# EAGLE design cardampl1 (EAGLE 5.08)
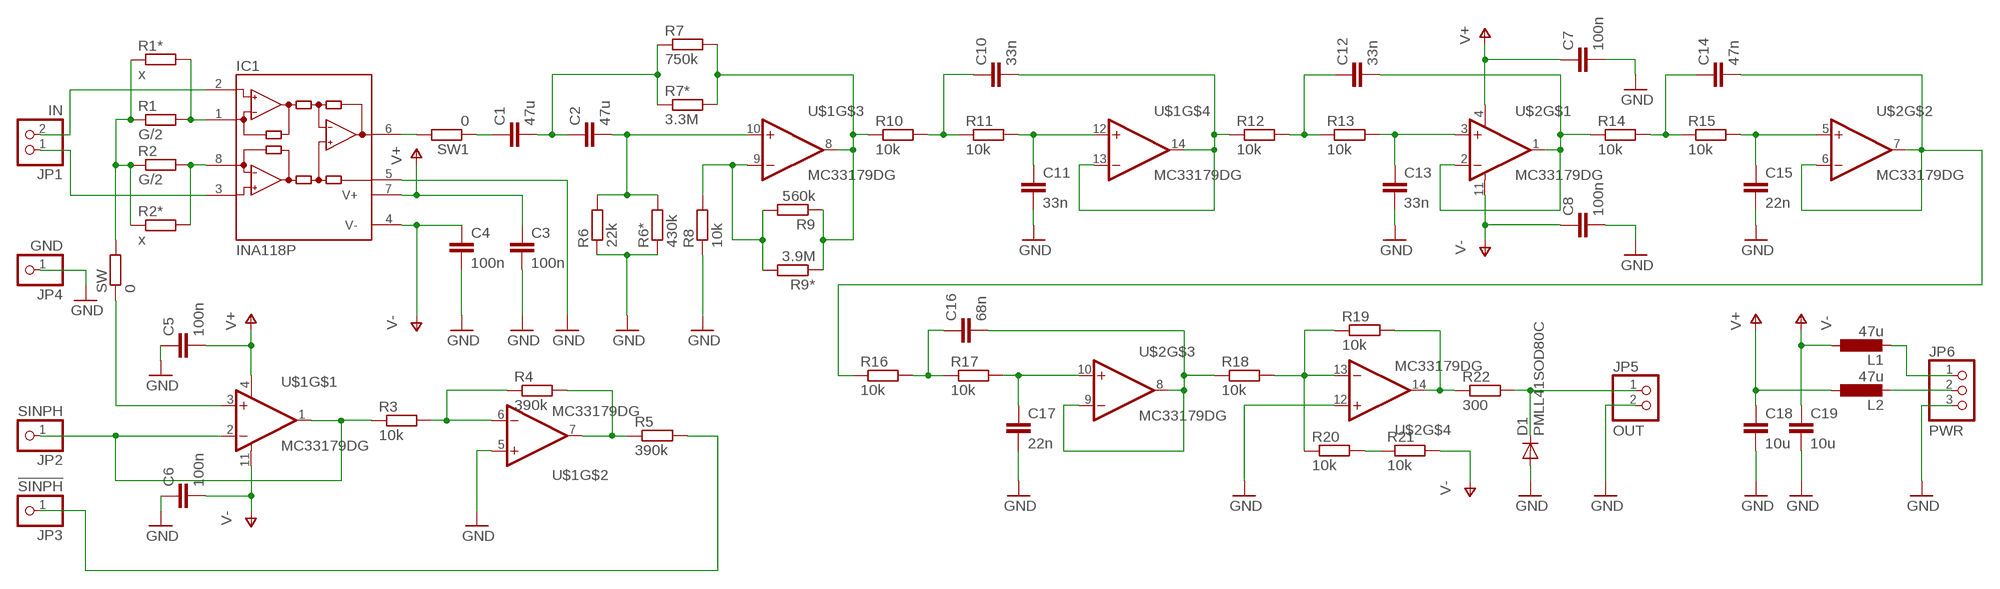
[diagram p0: schematic, sheet 1]

## Parts
C1  47u  C-EU025-050X050  [C025-050X050]
C2  47u  C-EU025-050X050  [C025-050X050]
C3  100n  C-EUC1206  [C1206]
C4  100n  C-EUC1206  [C1206]
C5  100n  C-EUC1206  [C1206]
C6  100n  C-EUC1206  [C1206]
C7  100n  C-EUC1206  [C1206]
C8  100n  C-EUC1206  [C1206]
C10  33n  C-EU050-075X075  [C050-075X075]
C11  33n  C-EU050-075X075  [C050-075X075]
C12  33n  C-EU050-075X075  [C050-075X075]
C13  33n  C-EU050-075X075  [C050-075X075]
C14  47n  C-EU050-075X075  [C050-075X075]
C15  22n  C-EU050-075X075  [C050-075X075]
C16  68n  C-EU050-075X075  [C050-075X075]
C17  22n  C-EU050-075X075  [C050-075X075]
C18  10u  C-EUC1206  [C1206]
C19  10u  C-EUC1206  [C1206]
D1  PMLL41SOD80C  [SOD80C]
IC1  INA118P  [DIL08]
JP1  IN  PINHD-1X2  [1X02]
JP2  SINPH  PINHD-1X1  [1X01]
JP3  !SINPH  PINHD-1X1  [1X01]
JP4  GND  PINHD-1X1  [1X01]
JP5  OUT  PINHD-1X2  [1X02]
JP6  PWR  PINHD-1X3/90  [1X03/90]
L1  47u  L-EUL1812  [L1812]
L2  47u  L-EUL1812  [L1812]
R1  G/2  R-EU_0207/15  [0207/15]
R1*  x  R-EU_0207/15  [0207/15]
R2  G/2  R-EU_0207/15  [0207/15]
R2*  x  R-EU_0207/15  [0207/15]
R3  10k  R-EU_R1206  [R1206]
R4  390k  R-EU_R1206  [R1206]
R5  390k  R-EU_R1206  [R1206]
R6  22k  R-EU_0207/12  [0207/12]
R6*  430k  R-EU_0207/12  [0207/12]
R7  750k  R-EU_0207/12  [0207/12]
R7*  3.3M  R-EU_0207/12  [0207/12]
R8  10k  R-EU_R0805  [R0805]
R9  560k  R-EU_0207/12  [0207/12]
R9*  3.9M  R-EU_0207/12  [0207/12]
R10  10k  R-EU_R0805  [R0805]
R11  10k  R-EU_R0805  [R0805]
R12  10k  R-EU_R0805  [R0805]
R13  10k  R-EU_R0805  [R0805]
R14  10k  R-EU_R0805  [R0805]
R15  10k  R-EU_R0805  [R0805]
R16  10k  R-EU_R0805  [R0805]
R17  10k  R-EU_R0805  [R0805]
R18  10k  R-EU_R0805  [R0805]
R19  10k  R-EU_R0805  [R0805]
R20  10k  R-EU_R0805  [R0805]
R21  10k  R-EU_R0805  [R0805]
R22  300  R-EU_R0805  [R0805]
SW  0  R-EU_M0805  [M0805]
SW1  0  R-EU_M0805  [M0805]
U$1  MC33179DG  [SO14]
U$2  MC33179DG  [SO14]

## Nets
GND: C3.2 C4.2 C5.1 C6.1 C7.2 C8.2 C11.2 C13.2 C15.2 C17.2 C18.2 C19.2 D1.A IC1.5(REF) JP4.1 JP5.2 JP6.3 R6*.1 R6.1 R8.1 U$1.5(+IN) U$2.12(+IN)
N$1: IC1.2(-IN) JP1.2
N$2: IC1.3(+IN) JP1.1
N$3: IC1.1(RG) R1*.2 R1.2
N$4: IC1.8(RG) R2*.2 R2.2
N$5: SW.1 U$1.3(+IN)
N$6: JP2.1 R3.1 U$1.1(OUT) U$1.2(-IN)
N$7: C10.1 R10.2 R11.1
N$8: R3.2 R4.1 U$1.6(-IN)
N$9: R18.2 R19.1 R20.1 U$2.13(-IN)
N$10: R4.2 R5.1 U$1.7(OUT)
N$11: JP3.1 R5.2
N$12: C13.1 R13.2 U$2.3(+IN)
N$13: C11.1 R11.2 U$1.12(+IN)
N$14: R19.2 R22.1 U$2.14(OUT)
N$15: C12.2 R14.1 U$2.1(OUT) U$2.2(-IN)
N$16: IC1.6(OUT) SW1.2
N$17: R1*.1 R1.1 R2*.1 R2.1 SW.2
N$18: C1.1 SW1.1
N$19: D1.C JP5.1 R22.2
N$20: C2.2 R6*.2 R6.2 U$1.10(+IN)
N$21: JP6.1 L1.2
N$22: R8.2 R9*.2 R9.2 U$1.9(-IN)
N$23: C10.2 R12.1 U$1.13(-IN) U$1.14(OUT)
N$24: JP6.2 L2.2
N$25: C12.1 R12.2 R13.1
N$26: C14.1 R14.2 R15.1
N$27: C16.1 R16.2 R17.1
N$28: R7*.2 R7.2 R9*.1 R9.1 R10.1 U$1.8(OUT)
N$29: C1.2 C2.1 R7*.1 R7.1
N$30: R20.2 R21.1
N$31: C15.1 R15.2 U$2.5(+IN)
N$32: C14.2 R16.1 U$2.6(-IN) U$2.7(OUT)
N$33: C16.2 R18.1 U$2.8(OUT) U$2.9(-IN)
N$35: C17.1 R17.2 U$2.10(+IN)
V+: C3.1 C5.2 C7.1 C18.1 IC1.7(V+) L2.1 U$1.4(V+) U$2.4(V+)
V-: C4.1 C6.2 C8.1 C19.1 IC1.4(V-) L1.1 R21.2 U$1.11(V-) U$2.11(V-)

## Library data of the parts
C1-C8 C10-C19 = rcl:C-EU: CAPACITOR, European symbol
D1 = diode:PMLL41*: High-speed diodes Source: http://www.semiconductors.philips.com/acrobat_download/datasheets/PMLL4150_2.pdf
IC1 = burr-brown:INA118: Instrumentation Amplifier Precision, Low Power
JP1 JP5 = pinhead:PINHD-1X2: PIN HEADER
JP2-JP4 = pinhead:PINHD-1X1: PIN HEADER
JP6 = pinhead:PINHD-1X3: PIN HEADER
L1 L2 = rcl:L-EU: INDUCTOR, European symbol
R1 R1* R2 R2* R6 R6* R7 R7* R8 R9 R9* R10-R22 SW SW1 = rcl:R-EU_: RESISTOR, European symbol
R3-R5 = resistor:R-EU_: RESISTOR, European symbol
U$1 U$2 = OU:MC33179DG

## Board
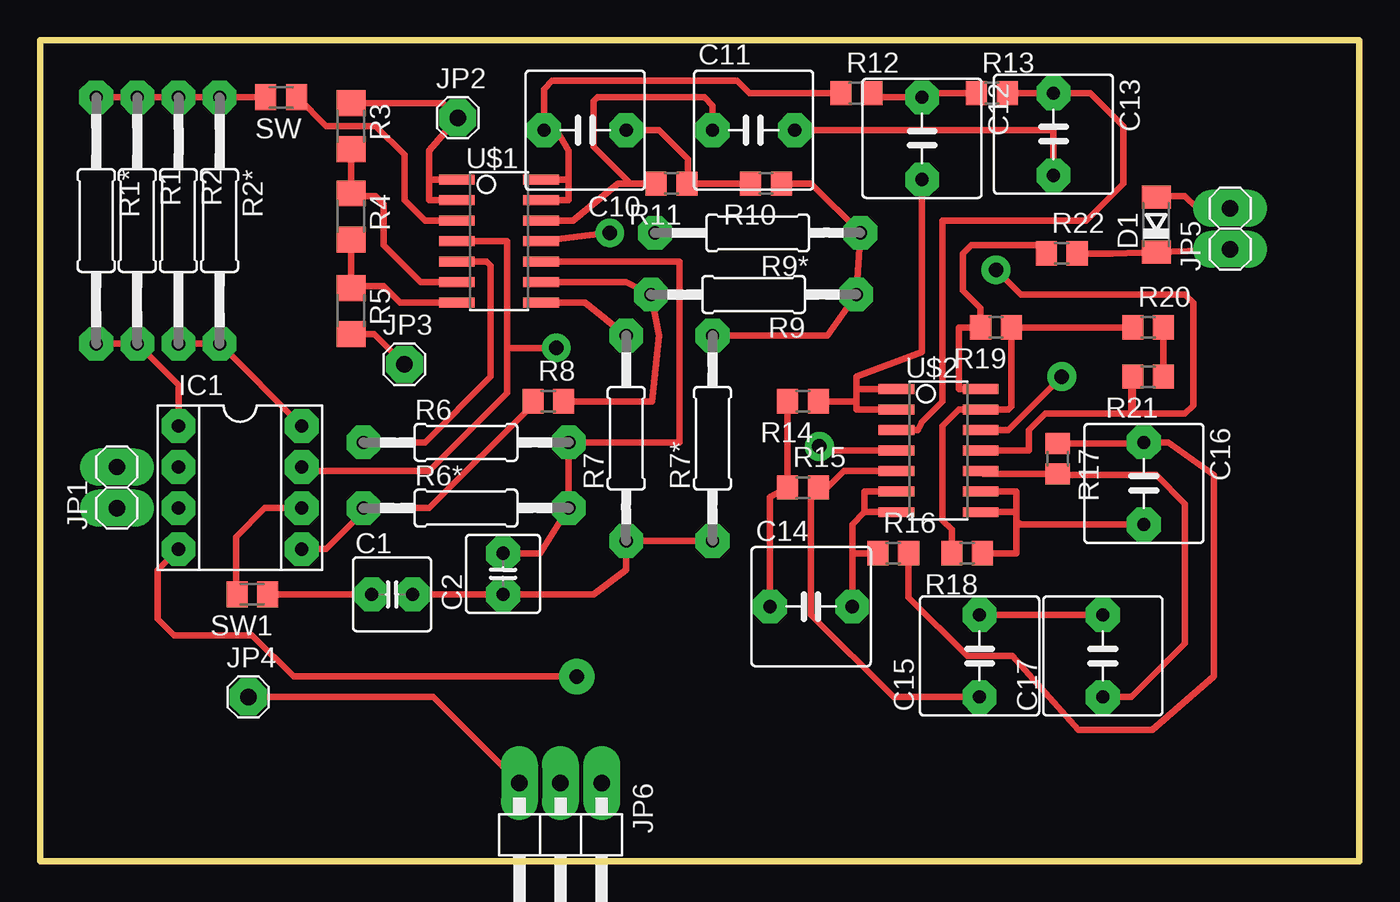
[diagram p1: board, top side]
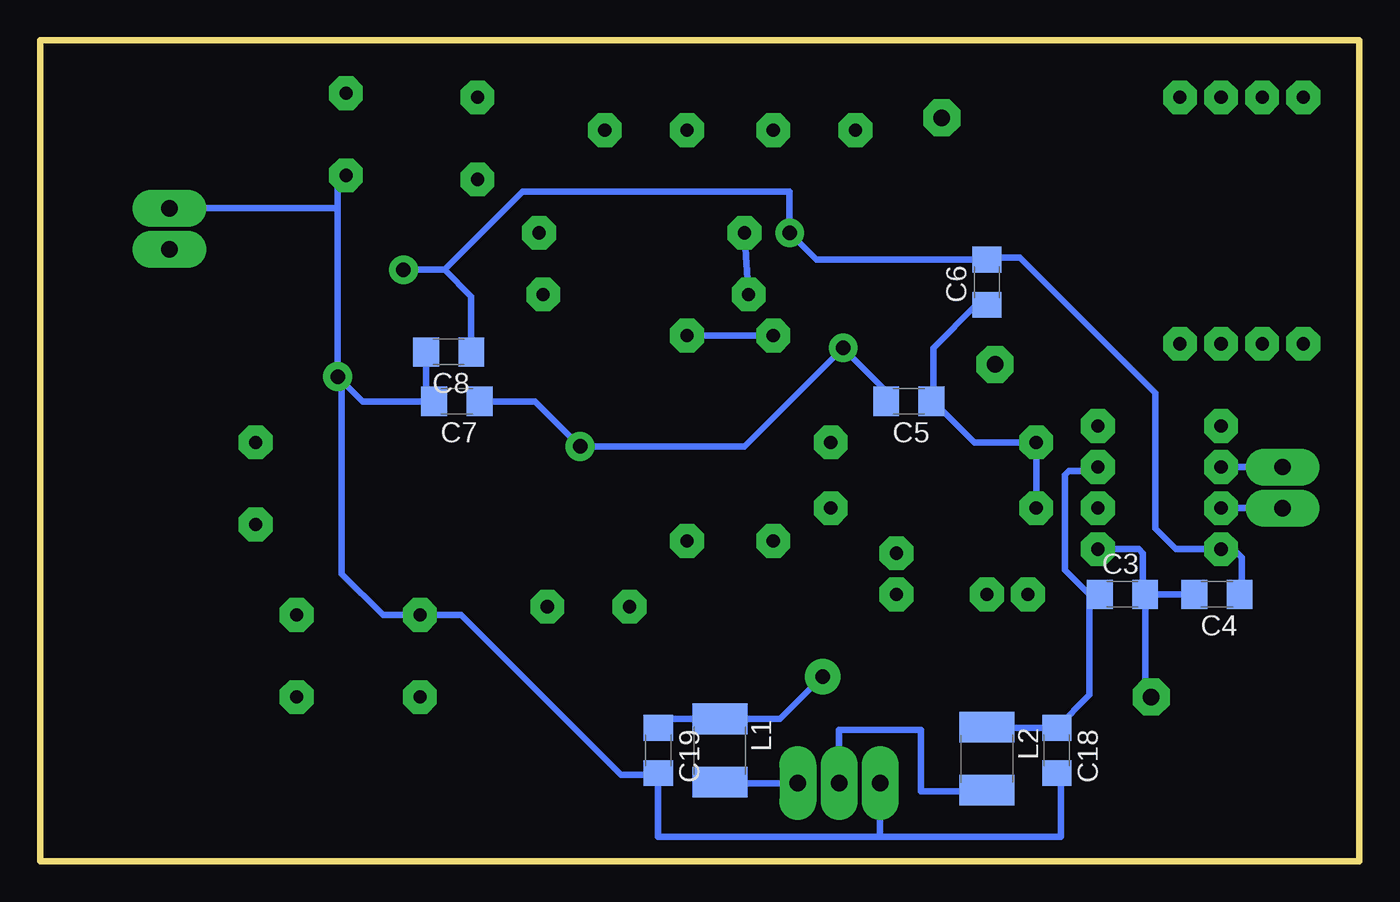
[diagram p2: board, bottom side, seen from below]

Size 81.52 x 50.76 mm. Coordinates in mm from the lower left corner, seen from the top.
Outline: 81.52,0 0,0 0,50.76 81.52,50.76 81.52,0
Copper layers (1*16): Top 0.035mm / dielectric 1.5mm / Bottom 0.035mm
Design rules "default *": minimum track width 16mil, minimum drill 32mil, track to track 16mil, track to pad 16mil, pad to pad 16mil, via to via 16mil, smd to smd 16mil, copper to edge 40mil, drill to drill 40mil, minimum pad ring 25mil, minimum via ring 12mil, stop-mask expansion 4mil, vias tented up to drill 0mil, thermal gap 10mil

### Footprints (pad centres in the part's own frame; a part is rotated, then mirrored left to right if it is on the bottom)
C025-050X050 = drill 0.813 octagon: 1 -1.27,0; 2 1.27,0
C1206 = smd 1.6 x 1.8: 1 -1.4,0; 2 1.4,0
C050-075X075 = drill 0.813 octagon: 1 -2.54,0; 2 2.54,0
SOD80C = smd 1.4 x 1.8: A 1.7,0; C -1.7,0
DIL08 = drill 0.813 pad 1.6 octagon: 1 -3.81,-3.81; 2 -1.27,-3.81; 3 1.27,-3.81; 4 3.81,-3.81; 5 3.81,3.81; 6 1.27,3.81; 7 -1.27,3.81; 8 -3.81,3.81
1X02 = drill 1.016 long: 1 -1.27,0; 2 1.27,0
1X01 = drill 1.016 octagon: 1 0,0
1X03/90 = drill 1.016 long: 1 -2.54,-3.81; 2 0,-3.81; 3 2.54,-3.81
L1812 = smd 1.9 x 3.4: 1 -1.95,0; 2 1.95,0
0207/15 = drill 0.813 octagon: 1 -7.62,0; 2 7.62,0
R1206 = smd 1.6 x 1.803: 1 -1.422,0; 2 1.422,0
0207/12 = drill 0.813 octagon: 1 -6.35,0; 2 6.35,0
R0805 = smd 1.3 x 1.5: 1 -0.95,0; 2 0.95,0
M0805 = smd 1.3 x 1.6: 1 -0.95,0; 2 0.95,0
SO14 = smd 0.61 x 2.21: 1 -3.81,-2.603; 2 -2.54,-2.603; 3 -1.27,-2.603; 4 0,-2.603; 5 1.27,-2.603; 6 2.54,-2.603; 7 3.81,-2.603; 8 3.81,2.603; 9 2.54,2.603; 10 1.27,2.603; 11 0,2.603; 12 -1.27,2.603; 13 -2.54,2.603; 14 -3.81,2.603

### Placement (x,y rotation side)
C1  21.74,16.51 0 top
C2  28.6,17.78 90 top
C3  14.63,16.51 0 bottom
C4  8.79,16.51 180 bottom
C5  27.84,28.45 180 bottom
C6  23.01,35.81 90 bottom
C7  55.78,28.45 180 bottom
C8  56.28,31.5 180 bottom
C10  33.68,45.21 180 top
C11  44.09,45.21 0 top
C12  54.51,44.7 270 top
C13  62.63,44.96 270 top
C14  47.65,15.75 0 top
C15  58.06,12.7 90 top
C16  68.22,23.37 270 top
C17  65.68,12.7 90 top
C18  18.69,6.86 270 bottom
C19  43.33,6.86 270 bottom
D1  68.98,39.37 90 top
IC1  12.34,23.11 270 top
JP1  4.72,23.11 90 top
JP2  25.8,45.97 0 top
JP3  22.5,30.73 0 top
JP4  12.85,10.16 0 top
JP5  73.56,39.12 90 top
JP6  32.15,1.02 180 top
L1  39.52,6.86 270 bottom
L2  23.01,6.35 270 bottom
R1  5.99,39.62 270 top
R1*  3.45,39.62 270 top
R2  8.53,39.62 270 top
R2*  11.07,39.62 270 top
R3  19.2,45.47 270 top
R4  19.2,39.88 270 top
R5  19.2,34.04 270 top
R6  26.31,25.91 0 top
R6*  26.31,21.84 0 top
R7  36.22,26.16 90 top
R7*  41.55,26.16 90 top
R8  31.39,28.45 0 top
R9  44.09,35.05 180 top
R9*  44.35,38.86 180 top
R10  44.85,41.91 180 top
R11  39.01,41.91 180 top
R12  50.44,47.5 0 top
R13  58.82,47.5 0 top
R14  47.14,28.45 180 top
R15  47.14,23.11 0 top
R16  52.73,19.05 0 top
R17  62.89,24.89 270 top
R18  57.3,19.05 180 top
R19  59.08,33.02 180 top
R20  68.48,33.02 0 top
R21  68.48,29.97 180 top
R22  63.14,37.59 0 top
SW  14.88,47.24 180 top
SW1  13.1,16.51 180 top
U$1  28.34,38.35 270 top
U$2  55.52,25.4 270 top

### Tracks (layer width: path | path; a pad name or v marks a point on that pad's centre or on a via)
GND  (via drill 0.9 pad 1.78)
  Top 0.406: U$1.5 27.58,37.08 27.84,36.83 27.84,29.97 23.77,25.91 R6.1 | IC1.5 17.68,19.3 19.96,21.59 R6*.1 24.03,21.84 30.44,28.26 R8.1 | C11.2 62.63,45.21 C13.2 | C15.2 C17.2 | U$2.12 59.84,26.67 v63.14,29.97 | JP5.2 71.52,40.39 70.76,41.15 69.06,41.15 D1.A | JP4.1 24.28,10.16 JP6.3
  Bottom 0.406: R6*.1 R6.1 23.77,25.91 26.31,28.45 C5.1 26.31,28.57 26.31,31.75 23.65,34.41 C6.1 | v63.14,29.97 63.14,40.39 | C13.2 63.14,41.91 63.14,40.39 | v63.14,29.97 62.89,29.72 62.89,17.78 60.35,15.24 C15.2 55.52,15.24 45.62,5.33 43.45,5.33 C19.2 43.33,1.52 29.61,1.52 | v63.14,29.97 61.62,28.45 C7.2 57.68,28.96 C8.2 | 63.14,40.39 JP5.2 | IC1.5 13.61,19.3 13.36,19.05 13.36,16.64 C3.2 | C3.2 C4.2 | C3.2 13.23,10.54 JP4.1 | 29.61,1.52 JP6.3 | 29.61,1.52 18.44,1.52 18.44,5.2 C18.2
N$1
  Bottom 0.406: IC1.2 JP1.2
N$2
  Bottom 0.406: IC1.3 JP1.1
N$3
  Top 0.406: IC1.1 8.53,29.46 R1.2 R1*.2
N$4
  Top 0.406: R2.2 R2*.2 IC1.8
N$5
  Top 0.406: SW.1 15.9,47.24 17.68,45.47 20.72,45.47 22.5,43.69 22.5,40.89 23.77,39.62 U$1.3
N$6
  Top 0.406: R3.1 24.89,46.89 JP2.1 24.03,43.94 24.03,42.16 | 24.03,42.16 24.03,40.89 U$1.2 | 24.03,42.16 U$1.1
N$7
  Top 0.406: R10.2 R11.1 40.03,41.98 40.03,43.43 38.25,45.21 C10.1
N$8
  Top 0.406: R3.2 R4.1 19.35,41.15 20.72,41.15 21.23,40.64 21.23,38.1 23.52,35.81 U$1.6
N$9
  Top 0.406: R18.2 56.35,20.51 55.78,21.08 55.78,26.92 56.79,27.94 U$2.13 59.84,27.94 60.03,28.13 R19.1 R20.1
N$10
  Top 0.406: R4.2 R5.1 19.3,35.56 21.23,35.56 22.25,34.54 U$1.7
N$11
  Top 0.406: R5.2 20.62,32.61 JP3.1
N$12
  Top 0.406: R13.2 C13.1 64.92,47.5 66.95,45.47 66.95,41.91 64.67,39.62 55.78,39.62 55.78,28.45 54.51,27.18 54.25,26.67 U$2.3
N$13
  Top 0.406: U$1.12 32.92,39.62 35.71,41.91 R11.2 36.47,41.91 34.19,44.2 34.19,46.99 34.44,47.24 41.04,47.24 41.55,46.74 C11.1
N$14
  Top 0.406: U$2.14 56.79,29.21 56.79,33.02 R19.2 58.13,34.22 57.05,35.31 57.05,37.59 57.55,38.1 61.68,38.1 R22.1
N$15
  Top 0.406: U$2.2 50.44,27.94 50.44,28.45 | 50.44,28.45 50.44,29.21 | 50.44,29.21 U$2.1 | R14.1 50.44,28.45 | C12.2 54.51,31.5 50.44,29.97 50.44,29.21
N$16
  Top 0.406: IC1.6 13.87,21.84 12.09,20.07 12.09,16.83 SW1.2
N$17
  Top 0.406: R1*.1 R1.1 R2.1 R2*.1 SW.2
N$18
  Top 0.406: C1.1 SW1.1
N$19
  Top 0.406: R22.2 66.27,37.59 D1.C 71.86,37.77 JP5.1
N$20
  Top 0.406: C2.2 30.88,19.05 R6*.2 R6.2 39.52,25.91 39.52,37.08 U$1.10
N$21
  Bottom 0.406: JP6.1 39.44,4.83 L1.2
N$22
  Top 0.406: U$1.9 36.22,35.81 R9.2 38.25,32.51 37.81,28.45 R8.2
  Bottom 0.406: R9.2 R9*.2
N$23
  Top 0.406: U$1.13 32.66,40.89 32.66,42.16 | U$1.14 32.66,42.16 | 32.66,42.16 32.66,43.94 31.9,45.21 C10.2 31.14,47.75 31.65,48.26 43.08,48.26 43.84,47.5 R12.1
N$24
  Bottom 0.406: JP6.2 32.15,8.13 27.07,8.13 27.07,4.32 23.09,4.32 L2.2
N$25
  Top 0.406: R12.2 51.65,47.24 C12.1 54.76,47.5 R13.1
N$26
  Top 0.406: C14.1 45.11,22.54 R15.1 R14.2
N$27
  Top 0.406: R17.1 68.16,25.84 C16.1 69.75,25.91 72.54,23.88 72.54,11.43 68.73,8.13 64.16,8.13 60.09,12.7 57.3,12.7 53.68,16.32 R16.2
N$28
  Top 0.406: R7.2 33.68,34.54 U$1.8 | R10.1 47.65,41.91 R9*.1 R9.1 48.66,32.51 R7*.2
  Bottom 0.406: R7*.2 R7.2
N$29
  Top 0.406: C1.2 C2.1 34.19,16.51 36.22,18.03 R7.1 R7*.1
N$30
  Top 0.406: R21.1 R20.2
N$31
  Top 0.406: U$2.5 49.68,24.13 48.66,23.11 R15.2 47.65,22.67 47.65,15.24 52.73,10.16 C15.1
N$32
  Top 0.406: U$2.6 50.95,22.86 50.95,21.59 | 50.95,21.59 U$2.7 | 50.19,19.05 50.19,20.83 50.95,21.59 | 50.19,19.05 C14.2 | R16.1 50.19,19.05
N$33
  Top 0.406: 60.35,21.59 U$2.8 | 60.35,21.59 60.35,22.86 U$2.9 | R18.1 60.35,19.05 60.35,21.08 | 60.35,21.08 60.35,21.59 | C16.2 60.6,20.83 60.35,21.08
N$35
  Top 0.406: C17.1 67.46,10.16 70.76,13.46 70.76,22.1 68.98,23.88 62.95,23.88 R17.2 58.31,23.94 U$2.10
V+  (via drill 0.9 pad 1.78)
  Top 0.406: U$1.4 28.85,38.35 28.85,31.75 | 28.85,31.75 28.85,28.96 24.03,24.13 16.41,24.13 IC1.7 | U$2.4 48.41,25.4 v48.16,25.65 | v31.9,31.75 28.85,31.75
  Bottom 0.406: C5.2 29.24,29.09 v31.9,31.75 38,25.65 v48.16,25.65 50.95,28.45 C7.1 | 16.66,16.51 C3.1 | 16.66,16.51 18.18,18.03 18.18,23.88 17.93,24.13 16.41,24.13 IC1.7 | L2.1 22.97,8.26 C18.1 16.66,10.29 16.66,16.51
V-  (via drill 0.9 pad 1.78, 0.9 pad 2.18)
  Top 0.406: U$1.11 v35.2,38.86 | U$2.11 61.11,25.4 61.11,26.67 62.13,27.69 67.46,27.69 | 67.46,27.69 67.46,29.4 R21.2 67.53,27.75 67.46,27.69 | 67.46,27.69 70.76,27.69 71.27,28.19 71.27,34.54 70.76,35.05 60.6,35.05 v59.08,36.58 | v33.17,11.43 15.64,11.43 13.1,13.97 8.28,13.97 7.26,14.99 7.26,18.03 IC1.4
  Bottom 0.406: 56.54,36.58 v59.08,36.58 | 56.54,36.58 51.71,41.4 35.2,41.4 v35.2,38.86 33.55,37.21 C6.2 22.89,37.34 20.98,37.34 12.6,28.96 12.6,20.57 11.33,19.3 IC1.4 7.77,19.3 7.26,18.8 7.26,16.63 C4.1 | C8.1 54.88,34.92 56.54,36.58 | C19.1 42.78,8.81 L1.1 35.79,8.81 v33.17,11.43